# EasyEDA Pro project ProProject_【常亮24天】 低功耗-迷你桌面时钟_2024-08-04.epro, schematic 桌面时钟4.0-电源板-v2.8.5（德州仪器）
Create Date: 2024-01-25; Page Name: 德州仪器版本.桌面时钟4.0-电源板-V2.8.5（德州仪器）; Project Name: 【常亮24天】 低功耗-迷你桌面时钟; Schematic Name: 桌面时钟4.0-电源板-V2.8.5（德州仪器）; Update Date: 2024-03-01; Company: 嘉立创EDA; Drawed: 联重的鸢崎; Page Size: A3; Reviewed: 联重的鸢崎; Version: V2.8.4
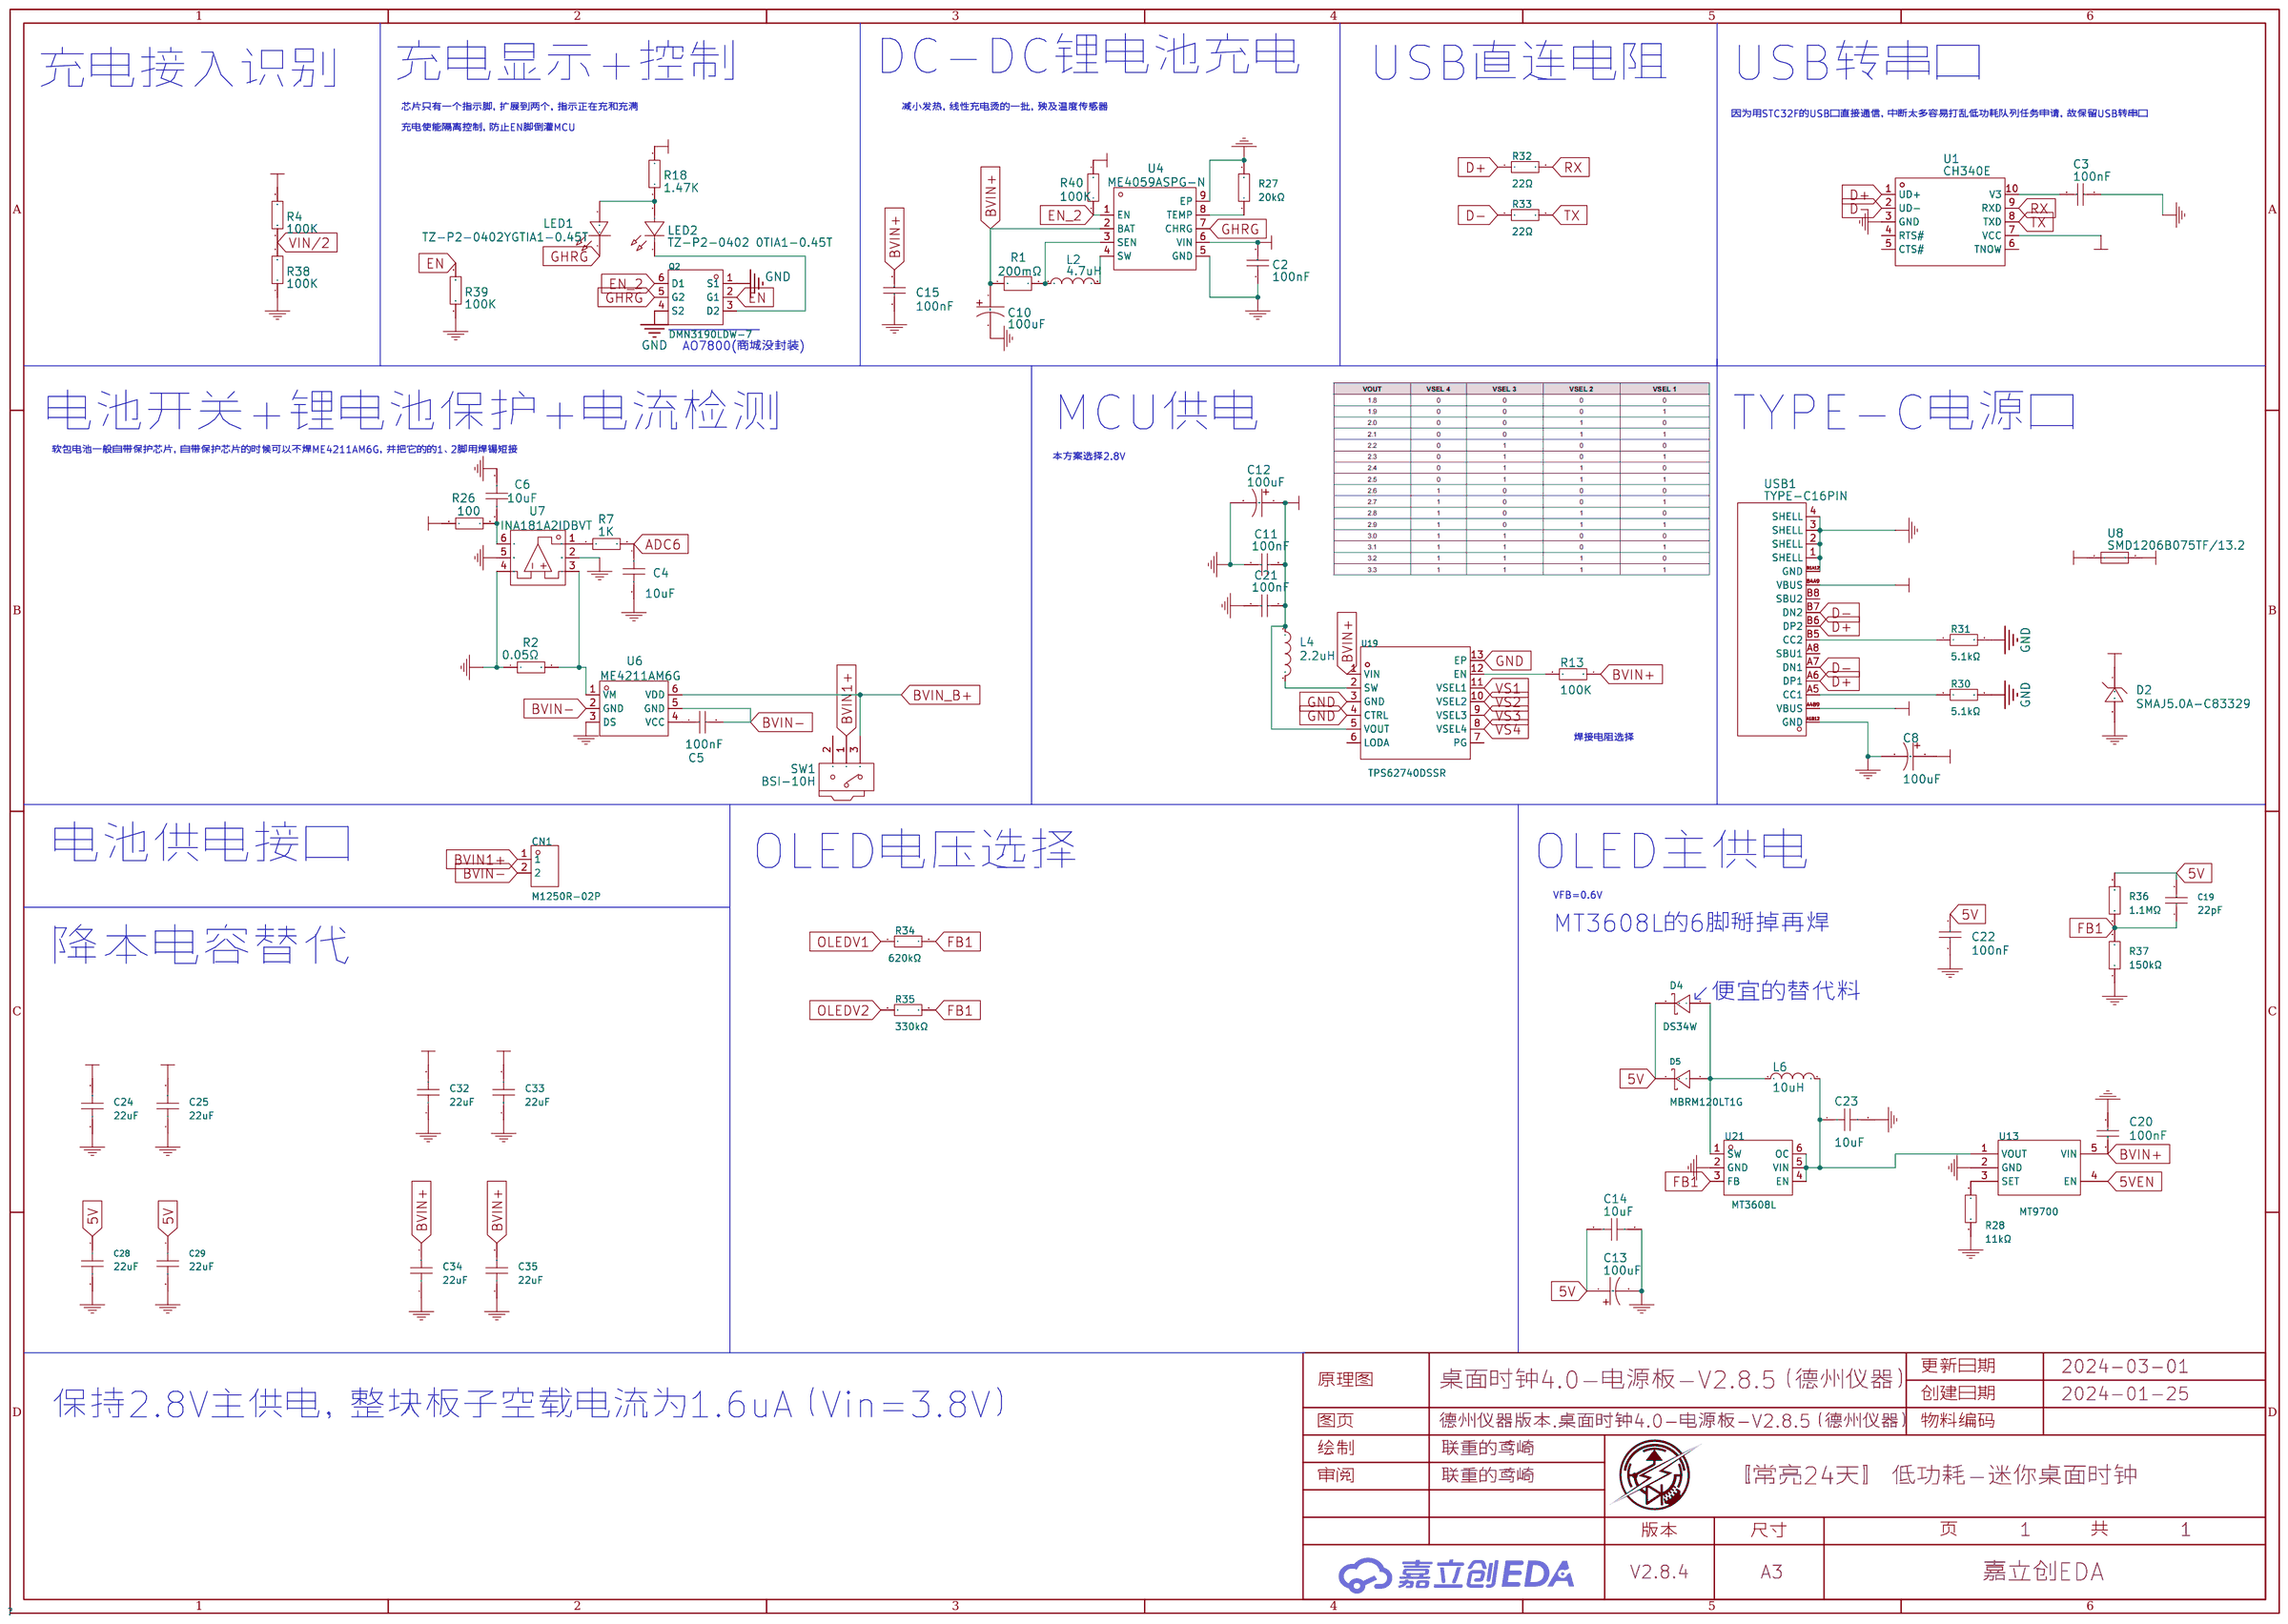
[diagram p0: schematic sheet]

## Parts
C2  100nF  [C0402]
C3  100nF  [C0402]
C4  10uF  [C0402]
C5  100nF  [C0402]
C6  10uF  [C0402]
C8  100uF  [CAP-SMD_L7.3-W4.3-FD]
C10  100uF  [CAP-SMD_L7.3-W4.3-FD]
C11  100nF  [C0402]
C12  100uF  [CAP-SMD_L7.3-W4.3-FD]
C13  100uF  [CAP-SMD_L7.3-W4.3-FD]
C14  10uF  [C0402]
C15  100nF  [C0402]
C19  22pF  [C0402]
C20  100nF  [C0402]
C21  100nF  [C0402]
C22  100nF  [C0402]
C23  10uF  [C0402]
C24  22uF  [C0603]
C25  22uF  [C0603]
C28  22uF  [C0603]
C29  22uF  [C0603]
C32  22uF  [C0603]
C33  22uF  [C0603]
C34  22uF  [C0603]
C35  22uF  [C0603]
CN1  M1250R-02P  [CONN-TH_2P-P1.25_L4.7-W4.3]
D2  SMAJ5.0A-C83329  [SMA_L4.3-W2.6-LS5.2-RD]
D4  DS34W  [SOD-123FL_L2.7-W1.8-LS3.8-RD]
D5  MBRM120LT1G  [DIO-SMD_L2.0-W1.9-LS3.8-RD]
L2  4.7uH  [IND-SMD_L4.1-W4.1_IHLP1616BZER4R7M11]
L4  2.2uH  [IND-SMD_L4.1-W4.1_IHLP1616BZER4R7M11]
L6  10uH  [IND-SMD_L4.1-W4.1_IHLP1616BZER4R7M11]
LED1  TZ-P2-0402YGTIA1-0.45T  [LED0402-RD_GREEN]
LED2  TZ-P2-0402 0TIA1-0.45T  [LED0402-RD_ORANGE]
Q2  DMN3190LDW-7  [SC-70-6_L2.2-W1.3-P0.65-LS2.1-BL]
R1  200mΩ  [R0805]
R2  0.05Ω  [R0805]
R4  100K  [R0402]
R7  1K  [R0402]
R13  100K  [R0402]
R18  1.47K  [R0402]
R26  100  [R0402]
R27  20kΩ  [R0402]
R28  11kΩ  [R0402]
R30  5.1kΩ  [R0402]
R31  5.1kΩ  [R0402]
R32  22Ω  [R0402]
R33  22Ω  [R0402]
R34  620kΩ  [R0402]
R35  330kΩ  [R0402]
R36  1.1MΩ  [R0402]
R37  150kΩ  [R0402]
R38  100K  [R0402]
R39  100K  [R0402]
R40  100K  [R0402]
SW1  BSI-10H  [SW-TH_BSI-10H]
U1  CH340E  [MSOP-10_L3.0-W3.0-P0.50-LS5.0-BL]
U4  ME4059ASPG-N  [ESOP-8_L4.9-W3.9-P1.27-LS6.0-BL-EP]
U6  ME4211AM6G  [SOT-23-6_L2.9-W1.6-P0.95-LS2.8-BR]
U7  INA181A2IDBVT  [SOT-23-6_L2.9-W1.6-P0.95-LS2.8-BR]
U8  SMD1206B075TF/13.2  [F1206]
U13  MT9700  [SOT-23-5_L3.0-W1.7-P0.95-LS2.8-BR]
U19  TPS62740DSSR  [WSON-12_L3.0-W2.0-P0.50-BL-EP]
U21  MT3608L  [SOT-23-6_L2.9-W1.7-P0.95-LS2.8-BL]
USB1  TYPE-C16PIN  [USB-C-SMD_TYPE-C16PIN]

## Library data of the parts
C2 C3 C5 C11 C15 C20-C22 = CC0402KRX5R7BB104: Supplier: LCSC; Supplier Part: C106204; Manufacturer: YAGEO; JLCPCB Part Class: Extended Part
C4 C6 C14 C23 = LDK105CBJ106MVLF: Supplier: LCSC; Supplier Part: C386033; Manufacturer: Taiyo Yuden; JLCPCB Part Class: Extended Part
C8 C10 C12 C13 = EEFCX1A101R: Supplier: LCSC; Supplier Part: C193235; Manufacturer: PANASONIC; JLCPCB Part Class: Extended Part
C19 = 0402CG220J500NT: 容值:22pF;精度:±5%;额定电压:50V;材质(温度系数):C0G;; LCSC Part Name: 22pF ±5% 50V; Supplier Part: C1555; Manufacturer: FH(风华); Supplier Footprint: 0402; JLCPCB Part Class: Basic Part; Datasheet: https://atta.szlcsc.com/upload/public/pdf/source/20200305/C486355_26A10D38EF8C2A5C37091D0039909270.pdf; Supplier: LCSC; Tolerance: ±5%; Voltage Rated: 50V; Temperature Coefficient: C0G
C24 C25 = CL10A226MQ8NRNC: 容值:22uF;精度:±20%;额定电压:6.3V;材质(温度系数):X5R;; LCSC Part Name: 22uF ±20% 6.3V; Supplier Part: C59461; Manufacturer: SAMSUNG(三星); Supplier Footprint: 0603; JLCPCB Part Class: 基础库; Datasheet: https://atta.szlcsc.com/upload/public/pdf/source/20160218/1457707763339.pdf; Supplier: LCSC; Tolerance: ±20%; Voltage Rated: 6.3V; Temperature Coefficient: X5R
C28 C29 = CL10A226MO7JZNC: 容值:22uF;精度:±20%;额定电压:16V;材质(温度系数):X5R;; LCSC Part Name: 22uF ±20% 16V; Supplier Part: C2762594; Manufacturer: SAMSUNG(三星); Supplier Footprint: 0603; JLCPCB Part Class: 扩展库; Datasheet: https://atta.szlcsc.com/upload/public/pdf/source/20220811/0832C3B1C642040B023B7A6186895861.pdf; Supplier: LCSC; Tolerance: ±20%; Voltage Rated: 16V; Temperature Coefficient: X5R
C32-C35 = CL10A226MP8NUNE: 容值:22uF;精度:±20%;额定电压:10V;材质(温度系数):X5R;; LCSC Part Name: 22uF ±20% 10V; Supplier Part: C86295; Manufacturer: SAMSUNG(三星); Supplier Footprint: 0603; JLCPCB Part Class: 扩展库; Datasheet: https://atta.szlcsc.com/upload/public/pdf/source/20160218/1457707763339.pdf; Supplier: LCSC; Tolerance: ±20%; Voltage Rated: 10V; Temperature Coefficient: X5R
CN1 = M1250R-02P: 参考系列:-;间距:1.25mm;插针结构:1x2P;排数:1;每排PIN数:2;行距:-;公母:公型插针;安装方式:弯插;额定电流:1A;工作温度范围:-25℃~+85℃;; LCSC Part Name: 1.25mm 1x2P 弯插; Supplier Part: C481436; Manufacturer: XFCN(兴飞); Supplier Footprint: 弯插,P=1.25mm; JLCPCB Part Class: 扩展库; Datasheet: https://atta.szlcsc.com/upload/public/pdf/source/20200107/C481436_D30FD834A6588CAF1DCD364C1BCA4F88.pdf; Supplier: LCSC; Pitch: 1.25mm; Pins Structure: 1x2P; Number of Rows: 1; Number of PINs Per Row: 2; Gender: 公型插针; Mounting Style: 弯插; Current Rating (Max): 1A; Operating Temperature Range: -25℃~+85℃
D2 = SMAJ5.0A: Supplier: LCSC; Manufacturer: Littelfuse(美国力特); Supplier Part: C83329; JLCPCB Part Class: Extended Part
D4 = DS34W: 直流反向耐压(Vr):40V;平均整流电流(Io):3A;正向压降(Vf):550mV@3A;; LCSC Part Name: 40V 3A 550mV@3A; Supplier Part: C475668; Manufacturer: SHIKUES(时科); Supplier Footprint: SOD-123FL; JLCPCB Part Class: Extended Part; Datasheet: https://atta.szlcsc.com/upload/public/pdf/source/20200113/C475668_6F5D64B390F718EFB2A870E34C979DAF.pdf; Supplier: LCSC; Reverse Voltage (Vr): 40V; Average Rectified Current (Io): 3A; Forward Voltage (Vf@If): 550mV@3A
D5 = MBRM120LT1G: 直流反向耐压(Vr):20V;平均整流电流(Io):1A;正向压降(Vf):450mV@1A;; LCSC Part Name: 电压:20V 电流:1A 1.0 A, 20 V, Schottky Power Rectifier, Surface Mount; Supplier Part: C32150; Manufacturer: onsemi(安森美); Supplier Footprint: POWERMITE; JLCPCB Part Class: 扩展库; Datasheet: https://atta.szlcsc.com/upload/public/pdf/source/20200807/C236085_74804F8237D9E8EDF75F3D34ECDA7526.pdf; Supplier: LCSC; Reverse Voltage (Vr): 20V; Average Rectified Current (Io): 1A; Forward Voltage (Vf@If): 450mV@1A; Reverse Leakage Current (Ir): 400uA@20V
L2 L4 L6 = IHLP1616BZER4R7M11: Supplier: LCSC; Supplier Part: C553980; Manufacturer: VISHAY(威世); JLCPCB Part Class: Extended Part
LED1 = TZ-P2-0402YGTIA1-0.45T: Supplier: LCSC; Supplier Part: C688878; Manufacturer: TUOZHAN; JLCPCB Part Class: Extended Part
LED2 = TZ-P2-0402 0TIA1-0.45T: Supplier: LCSC; Supplier Part: C779448; Manufacturer: TUOZHAN; JLCPCB Part Class: Extended Part
Q2 = DMN3190LDW-7: 类型:2个N沟道;漏源电压(Vdss):30V;连续漏极电流(Id):1A;功率(Pd):320mW;导通电阻(RDS(on)@Vgs,Id):190mΩ@10V,1.3A;; LCSC Part Name: 2个N沟道 耐压:30V 电流:1A; Supplier Part: C154750; Manufacturer: DIODES(美台); Supplier Footprint: SOT-363-6(SC-70-6); JLCPCB Part Class: 扩展库; Datasheet: https://atta.szlcsc.com/upload/public/pdf/source/20171221/C154750_15138395263561195847.pdf; Supplier: LCSC; Type: 2个N沟道; Drain Source Voltage (Vdss): 30V; Continuous Drain Current (Id): 1A; Power Dissipation (Pd): 320mW; Drain Source On Resistance (RDS(on)@Vgs,Id): 190mΩ@10V,1.3A; Gate Threshold Voltage (Vgs(th)@Id): 2.8V@250uA; Total Gate Charge (Qg@Vgs): 2nC@10V; Input Capacitance (Ciss@Vds): 87pF@20V; Operating Temperature: -55℃~+150℃@(Tj)
R1 = ERJU6SFR20V: Supplier: LCSC; Supplier Part: C491242; Manufacturer: PANASONIC; JLCPCB Part Class: Extended Part
R2 = CS05W4F500MT5E: Supplier: LCSC; Supplier Part: C270863; Manufacturer: Uniroyal Elec; Resistance: 0.05; JLCPCB Part Class: Extended Part
R4 R38-R40 = CR0402-JW-224GLF: Supplier: LCSC; Supplier Part: C203142; Manufacturer: BOURNS; JLCPCB Part Class: Extended Part; Resistance: 220kΩ
R7 = AC0402JR-071KL: Supplier: LCSC; Manufacturer: YAGEO; Supplier Part: C138287; JLCPCB Part Class: Extended Part; Resistance: 1kΩ
R13 = AC0402JR-07100KL: Supplier: LCSC; Manufacturer: YAGEO; Supplier Part: C144732; JLCPCB Part Class: Extended Part; Resistance: 100kΩ
R18 = AC0402FR-071K47L: Supplier: LCSC; Supplier Part: C226852; Manufacturer: YAGEO; JLCPCB Part Class: Extended Part; Resistance: 1.47kΩ
R26 = AC0402FR-07100RL: Supplier: LCSC; Supplier Part: C144808; Manufacturer: YAGEO; JLCPCB Part Class: Extended Part
R27 = 0402WGF2002TCE: 电阻类型:厚膜电阻;阻值:20kΩ;精度:±1%;功率:62.5mW;; LCSC Part Name: 20kΩ ±1% 62.5mW; Supplier Part: C25765; Manufacturer: UNI-ROYAL(厚声); Supplier Footprint: 0402; JLCPCB Part Class: Basic Part; Datasheet: https://atta.szlcsc.com/upload/public/pdf/source/20200306/C422600_1E6D84923E4A46A82E41ADD87F860B5C.pdf; Supplier: LCSC; Type: 厚膜电阻; Tolerance: ±1%; Power(Watts): 62.5mW; Temperature Coefficient: ±100ppm/℃; Overload Voltage (Max): 50V; Operating Temperature Range: -55℃~+155℃
R28 = 0402WGF1102TCE: 电阻类型:厚膜电阻;阻值:11kΩ;精度:±1%;功率:62.5mW;; LCSC Part Name: 11kΩ ±1% 62.5mW; Supplier Part: C25749; Manufacturer: UNI-ROYAL(厚声); Supplier Footprint: 0402; JLCPCB Part Class: Extended Part; Datasheet: https://atta.szlcsc.com/upload/public/pdf/source/20200306/C422600_1E6D84923E4A46A82E41ADD87F860B5C.pdf; Supplier: LCSC; Type: 厚膜电阻; Tolerance: ±1%; Power(Watts): 62.5mW; Temperature Coefficient: ±100ppm/℃; Overload Voltage (Max): 50V; Operating Temperature Range: -55℃~+155℃
R30 R31 = 0402WGF5101TCE: 阻值:5.1kΩ;精度:±1%;功率:62.5mW;温度系数:±100ppm/℃;电阻类型:厚膜电阻;; LCSC Part Name: 5.1kΩ ±1% 62.5mW 厚膜电阻; Supplier Part: C25905; Manufacturer: UNI-ROYAL(厚声); Supplier Footprint: 0402; JLCPCB Part Class: Basic Part; Datasheet: https://atta.szlcsc.com/upload/public/pdf/source/20200306/C422600_1E6D84923E4A46A82E41ADD87F860B5C.pdf; Supplier: LCSC; Tolerance: ±1%; Power(Watts): 62.5mW; Overload Voltage (Max): 50V; Temperature Coefficient: ±100ppm/℃; Type: 厚膜电阻; Operating Temperature Range: -55℃~+155℃
R32 R33 = 0402WGF220JTCE: 阻值:22Ω;精度:±1%;功率:62.5mW;温度系数:±100ppm/℃;电阻类型:厚膜电阻;; LCSC Part Name: 22Ω ±1% 62.5mW 厚膜电阻; Supplier Part: C25092; Manufacturer: UNI-ROYAL(厚声); Supplier Footprint: 0402; JLCPCB Part Class: Basic Part; Datasheet: https://atta.szlcsc.com/upload/public/pdf/source/20200306/C422600_1E6D84923E4A46A82E41ADD87F860B5C.pdf; Supplier: LCSC; Tolerance: ±1%; Power(Watts): 62.5mW; Overload Voltage (Max): 50V; Temperature Coefficient: ±100ppm/℃; Type: 厚膜电阻; Operating Temperature Range: -55℃~+155℃
R34 = AC0402JR-07620KL: 电阻类型:厚膜电阻;阻值:620kΩ;精度:±5%;功率:62.5mW;; LCSC Part Name: 620kΩ ±5% 62.5mW; Supplier Part: C227402; Manufacturer: YAGEO(国巨); Supplier Footprint: 0402; JLCPCB Part Class: Extended Part; Datasheet: https://atta.szlcsc.com/upload/public/pdf/source/20180927/C227402_885377D63A3EB96049F1287C73181178.pdf; Supplier: LCSC; Type: 厚膜电阻; Tolerance: ±5%; Power(Watts): 62.5mW; Temperature Coefficient: ±100ppm/℃; Overload Voltage (Max): 50V; Operating Temperature Range: -55℃~+155℃
R35 = 0402WGF3303TCE: 阻值:330kΩ;精度:±1%;功率:62.5mW;温度系数:±100ppm/℃;电阻类型:厚膜电阻;; LCSC Part Name: 330kΩ ±1% 62.5mW 厚膜电阻; Supplier Part: C25778; Manufacturer: UNI-ROYAL(厚声); Supplier Footprint: 0402; JLCPCB Part Class: Basic Part; Datasheet: https://atta.szlcsc.com/upload/public/pdf/source/20200306/C422600_1E6D84923E4A46A82E41ADD87F860B5C.pdf; Supplier: LCSC; Tolerance: ±1%; Power(Watts): 62.5mW; Overload Voltage (Max): 50V; Temperature Coefficient: ±100ppm/℃; Type: 厚膜电阻; Operating Temperature Range: -55℃~+155℃
R36 = RTT021104FTH: 电阻类型:厚膜电阻;阻值:1.1MΩ;精度:±1%;功率:62.5mW;最大工作电压:50V;温度系数:±100ppm/℃;; LCSC Part Name: 厚膜电阻 1.1MΩ ±1% 62.5mW; Supplier Part: C159143; Manufacturer: RALEC(旺诠); Supplier Footprint: 0402; JLCPCB Part Class: Extended Part; Datasheet: https://atta.szlcsc.com/upload/public/pdf/source/20191219/C158410_884373A5B7E1BC76BF57BC45A946C093.pdf; Supplier: LCSC; Type: 厚膜电阻; Tolerance: ±1%; Power(Watts): 62.5mW; Overload Voltage (Max): 50V; Temperature Coefficient: ±100ppm/℃; Operating Temperature Range: -55℃~+155℃
R37 = RC0402JR-07150KL: 电阻类型:厚膜电阻;阻值:150kΩ;精度:±5%;功率:62.5mW;最大工作电压:50V;温度系数:±100ppm/℃;; LCSC Part Name: 厚膜电阻 150kΩ ±5% 62.5mW; Supplier Part: C137919; Manufacturer: YAGEO(国巨); Supplier Footprint: 0402; JLCPCB Part Class: Extended Part; Datasheet: https://atta.szlcsc.com/upload/public/pdf/source/20181009/C309620_DA5935B6E1D48212CB7A533FE518B3C2.pdf; Supplier: LCSC; Type: 厚膜电阻; Tolerance: ±5%; Power(Watts): 62.5mW; Overload Voltage (Max): 50V; Temperature Coefficient: ±100ppm/℃; Operating Temperature Range: -55℃~+155℃
SW1 = BSI-10H: Supplier: LCSC; Supplier Part: C411270; Manufacturer: XINGWEN; JLCPCB Part Class: Extended Part
U1 = CH340E: Supplier: LCSC; Manufacturer: WCH; Supplier Part: C99652; JLCPCB Part Class: Extended Part
U4 = ME4059ASPG-N: Supplier: LCSC; Supplier Part: C427588; Manufacturer: Nanjing Micro One Elec
U6 = ME4211AM6G: Supplier: LCSC; Supplier Part: C2983846; Manufacturer: MICRONE(南京微盟); link: https://atta.szlcsc.com/upload/public/pdf/source/20220331/FAA8D8FDFBBC4768E214EC70CEC16D3B.pdf
U7 = INA181A2IDBVT: Supplier: LCSC; Supplier Part: C116200; Manufacturer: Texas Instruments; JLCPCB Part Class: Extend
U8 = SMD1206B075TF/13.2: Supplier: LCSC; Supplier Part: C269117; Manufacturer: Brightking(君耀电子); JLCPCB Part Class: Extended Part
U13 = MT9700: 低功耗负载开关/USB电源开关/限流保护开关; Supplier Part: C89855; Manufacturer: 西安航天民芯; Supplier Footprint: SOT-23-5; JLCPCB Part Class: 扩展库; Datasheet: https://atta.szlcsc.com/upload/public/pdf/source/20170418/1492481333031.pdf; Supplier: LCSC
U19 = TPS62740DSSR: 功能类型:降压型;输入电压:-;输出电压:1.8V~3.3V;输出电流(最大值):-;; Supplier Part: C128606; Manufacturer: TI(德州仪器); Supplier Footprint: DFN-12(2x3); JLCPCB Part Class: 扩展库; Datasheet: https://www.ti.com/cn/lit/gpn/tps62740; Supplier: LCSC; Function: 降压型; Number of Outputs: 1; Output Voltage: 1.8V~3.3V; Operating Temperature: -40℃~+85℃
U21 = MT3608L: Supplier Part: C2932326; Manufacturer: 西安航天民芯; Supplier Footprint: SOT-23-6; JLCPCB Part Class: 扩展库; Datasheet: https://atta.szlcsc.com/upload/public/pdf/source/20211213/953A62CC1033762E00AABAD4906DD7F1.pdf; Supplier: LCSC
USB1 = TYPE-C16PIN: Supplier: LCSC; Supplier Part: C393939; Manufacturer: SHOU HAN

## Nets
5V: C13.1 C14.2 C19.2 C22.1 C28.1 C29.1 D4.1(K) D5.1(C) R36.2
5VEN: U13.4(EN)
GND: C2.1 C3.1 C4.2 C6.1 C8.2 C10.2 C11.2 C12.2 C13.2 C14.1 C15.1 C20.2 C21.2 C22.2 C23.2 C24.1 C25.1 C28.2 C29.2 C32.1 C33.1 C34.1 C35.1 D2.2(A) Q2.1(S1) Q2.4(S2) R2.1 R27.2 R28.1 R30.2 R31.2 R37.1 R38.1 R39.1 U1.3(GND) U4.5(GND) U4.9(EP) U6.3(DS) U7.2(GND) U7.4(IN-) U7.5(REF) U13.2(GND) U19.3(GND) U19.4(CTRL) U19.13(EP) U21.2(GND) USB1.1(SHELL) USB1.2(SHELL) USB1.3(SHELL) USB1.4(SHELL) USB1.A1B12(GND) USB1.B1A12(GND)
VIN: C2.2 C8.1 C32.2 C33.2 D2.1(C) R4.2 R18.2 R26.1 R40.2 U1.7(VCC) U4.6(VIN) U8.2
VIN1: U8.1 USB1.A4B9(VBUS) USB1.B4A9(VBUS)
3.3: C11.1 C12.1 C21.1 C24.2 C25.2 L4.1 U19.5(VOUT)
ADC6: C4.1 R7.1
BVIN1+: CN1.1 SW1.1
BVIN+: C10.1 C15.2 C20.1 C34.2 C35.2 R1.1 R13.1 U4.2(BAT) U13.5(VIN) U19.1(VIN)
BVIN-: C5.2 CN1.2 U6.2(GND) U6.5(GND)
BVIN_B+: SW1.3 U6.6(VDD)
D+: R32.1 U1.1(UD+) USB1.A6(DP1) USB1.B6(DP2)
D-: R33.1 U1.2(UD-) USB1.A7(DN1) USB1.B7(DN2)
EN: Q2.2(G1) R39.2
EN_2: Q2.6(D1) R40.1 U4.1(EN)
FB1: C19.1 R34.2 R35.2 R36.1 R37.2 U21.3(FB)
GHRG: LED1.1 Q2.5(G2) U4.7(CHRG)
OLEDV1: R34.1
OLEDV2: R35.1
RX: R32.2 U1.9(RXD)
TX: R33.2 U1.8(TXD)
VIN/2: R4.1 R38.2
VS1: U19.11(VSEL1)
VS2: U19.10(VSEL2)
VS3: U19.9(VSEL3)
VS4: U19.8(VSEL4)
$1N57: R30.1 USB1.A5(CC1)
$1N121: LED1.2 LED2.2(+) R18.1
$1N151: R27.1 U4.8(TEMP)
$1N154: L2.2 U4.4(SW)
$1N155: L2.1 R1.2 U4.3(SEN)
$1N234: C3.2 U1.10(V3)
$1N676: R2.2 U6.1(VM) U7.3(IN+)
$1N681: C6.2 R26.2 U7.6(VS)
$1N911: C5.1 U6.4(VCC)
$1N920: R7.2 U7.1(OUT)
$1N2308: LED2.1(-) Q2.3(D2)
$1N12281: R28.2 U13.3(SET)
$1N17078: L4.2 U19.2(SW)
$1N17143: R13.2 U19.12(EN)
$1N22881: C23.1 L6.2 U13.1(VOUT) U21.4(EN) U21.5(VIN) U21.6(OC)
$1N30925: R31.1 USB1.B5(CC2)
$1N37752: D4.2(A) D5.2(A) L6.1 U21.1(SW)

Not connected (* = marked no-connect by the designer): SW1 2; U1 4(RTS#) 5(CTS#) 6(TNOW); U19 6(LODA) 7(PG); USB1 A8(SBU1) B8(SBU2)

## Notes on the sheet
- DC-DC锂电池充电
- 充电接入识别
- 充电显示+控制
- USB直连电阻
- USB转串口
- 芯片只有一个指示脚，扩展到两个，指示正在充和充满
- 减小发热，线性充电烫的一批，殃及温度传感器
- 因为用STC32F的USB口直接通信，中断太多容易打乱低功耗队列任务申请，故保留USB转串口
- 充电使能隔离控制，防止EN脚倒灌MCU
- _______
- AO7800(商城没封装)
- 电池开关+锂电池保护+电流检测
- MCU供电
- TYPE-C电源口
- 软包电池一般自带保护芯片，自带保护芯片的时候可以不焊ME4211AM6G，并把它的的1、2脚用焊锡短接
- 本方案选择2.8V
- 焊接电阻选择
- 电池供电接口
- OLED电压选择
- OLED主供电
- VFB=0.6V
- MT3608L的6脚掰掉再焊
- 降本电容替代
- ↙便宜的替代料
- 保持2.8V主供电，整块板子空载电流为1.6uA（Vin=3.8V）
